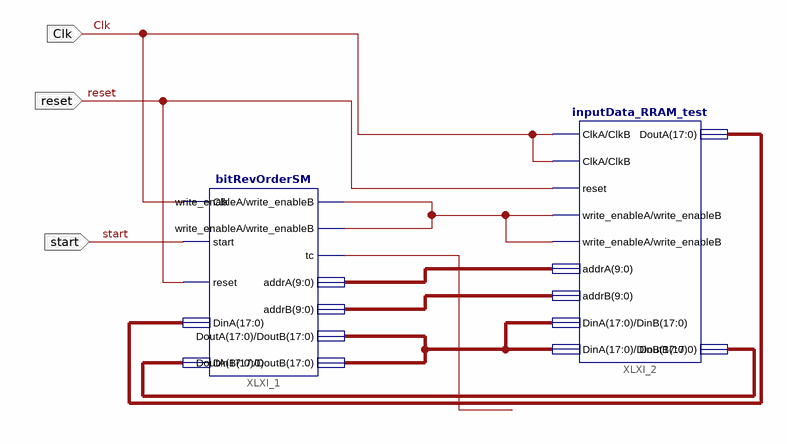
[diagram p0: schematic sheet 1]
// Xilinx ISE schematic test.sch (spartan6) as structural Verilog: 2 symbols, 3 ports
module test (
  input  reset,
  input  Clk,
  input  start
);

  wire XLXN_8, XLXN_12;
  wire [9:0] XLXN_9, XLXN_10;
  wire [17:0] XLXN_2, XLXN_6, XLXN_7;

  bitRevOrderSM XLXI_1 (
    .Clk(Clk), .start(start), .reset(reset), .DinA(XLXN_6), .DinB(XLXN_7), .write_enableA(XLXN_12),
    .write_enableB(XLXN_12), .tc(XLXN_8), .addrA(XLXN_9), .addrB(XLXN_10), .DoutA(XLXN_2), .DoutB(XLXN_2));
  inputData_RRAM_test XLXI_2 (
    .ClkA(Clk), .ClkB(Clk), .reset(reset), .write_enableA(XLXN_12), .write_enableB(XLXN_12), .addrA(XLXN_9),
    .addrB(XLXN_10), .DinA(XLXN_2), .DinB(XLXN_2), .DoutA(XLXN_6), .DoutB(XLXN_7));
endmodule
